# Altium schematic sheet Tone Level.SchDoc: Title
size 431 x 279 mm; Date: *******; ApprovedBy: *******; CheckedBy: Dahami Fernando; Author: *******; CompanyName: *******; DrawnBy: Rivikula Fernando; Engineer: *******; Organization: *******; Address1: *******; Address2: *******; Address3: *******; Address4: *******; DocumentNumber: 5; Revision: *******; SheetNumber: 5; SheetTotal: 7; Subtitle: Tone Level; Project: Distotion_Gitar_Pedal; VersionRevision: 1; TotalSheet: 8; CurrentTime: *******; CurrentDate: *******; Time: *******; DocumentFullPathAndName: *******; DocumentName: *******; ModifiedDate: *******; ImagePath: *******; ProjectName: *******; Application_BuildNumber: *******
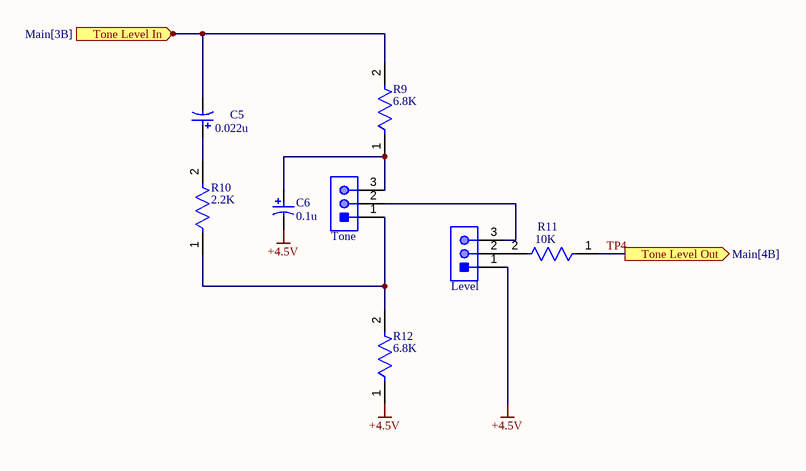
[diagram p0: Tone Level.SchDoc]

## Parts
C5  0.022u  [CAPPR55-200-1100X500X1200]
C6  0.1u  [CAPPR55-200-1100X500X1200]
Level  100K  [TECO-171825-3_V]  (value not drawn)
R9  6.8K  [FP-MRS1600-MFG]
R10  2.2K  [FP-MRS1600-MFG]
R11  10K  [FP-MRS1600-MFG]
R12  6.8K  [FP-MRS1600-MFG]
Tone  20K  [TECO-171825-3_V]  (value not drawn)

## Ports
Tone Level In (in, see Main[3B]), Tone Level Out (out, see Main[4B])

## Nets
+4.5V: C6.2 Level.1 R12.1
Tone Level In: C5.2 R9.2 ; port Tone Level In
TP4: R11.1 ; port Tone Level Out
NetC5_1: C5.1 R10.2
NetC6_1: C6.1 R9.1 Tone.3
NetLevel_2: Level.2 R11.2
NetLevel_3: Level.3 Tone.2
NetR10_1: R10.1 R12.2 Tone.1

## Notes on the sheet
- DWG. NO.
- REV.
- SHT.
- THIS DOCUMENT AND THE DATA DISCLOSED HEREIN OR HEREWITH IS THE PROPERTY OF ALTIUM LIMITED AND MAY BE FREELY DISTRIBUTED IN WHOLE. NO RIGHTS ARE RESERVED OR EXPRESS OR IMPLIED WARANTEE GIVEN.
- REVISION
- DESCRIPTION
- DATE
- APPROVED
- ENG:
- APPROVALS
- PROJECT
- DSN:
- CHK:
- REFERENCE DOCUMENTS
- PROJECT REVISION:
- TITLE
- DOCUMENT REVISION:
- DESIGN ITEM:
- BOM:
- FAB DWG:
- PCB DWG:
- ASSY DWG:
- SCALE:
- SIZE
- B
- CAGE CODE
- FILE NAME
- DWG NO.
- SHEET
- OF
- REV

## Library data of the parts
C5 C6 = CMP-1665-00036-2: Aluminum Electrolytic Capacitor, 22 uF, +/- 20%, 50 V, -40 to 85 degC, 2-Pin THD, RoHS, Bulk; Manufacturer: Panasonic; Ripple Current: 100mA; Life (Hours): 2000Hour; Voltage: 50V; Dissipation Factor: 0.12%; Leakage Current: 3uA; Lead/Base Style: Straight; Capacitance: 22uF; Lead Diameter: 0.5mm; Max Operating Temperature: 85degC; Height: 11mm; Package Reference: CAPPR55-200-1100X500X1200; Radiation Hardening: No; RoHSCompliant: true; Termination: Radial; Case/Package: Radial; REACH SVHC: NoSVHC; Height - Seated (Max): 0.472inch; Min Operating Temperature: -40degC; Packaging: Bulk; Manufacturer URL: http://www.panasonic.com/; Length: 11mm; Tolerance: 20%; Voltage Rating: 50V; Voltage Rating (DC): 50V; Datasheet URL: https://industrial.panasonic.com/cdbs/www-data/pdf/RDF0000/ABA0000C1218.pdf; Lead Pitch: 2mm; Ripple Current (AC): 100mA; Package Description: 2-Pin Radial Lead, Dia 5 mm, Height 12 mm; Diameter: 5mm; Datasheet Version: Rev. 05, 10/2016; Package Quantity: 200; Mount: ThroughHole
Level Tone = CMP-2000-07494-1: Male Header, Pitch 2.5 mm, 1 x 3 Position, Height 10.4 mm, Tail Length 3.6 mm, / -20 to 95 degC / , RoHS, Bulk; Manufacturer: TE Connectivity; Mating Alignment: Yes(With); Tail Length: 0.142inch; Mating Post Length: 7.5mm; PCB Thickness: 0.063inch; PCB Mount Alignment: No(Without); Voltage Rating: 350V; Max Voltage Rating (AC): 250V; Plating Thickness: 0.8um; PCB Mounting Orientation: Vertical; Number of Positions: 3; PCB Mount Retention: Without; Max Current Rating: 3.5A; Max Voltage Rating (DC): 350.25kV; Pitch: 2.5mm; Approvals: UL; Contact Resistance: 20mOhm; Mount: ThroughHole; Length: 7.5mm; Orientation: Straight; Contact Mating Length: 0.295inch; Contact Material: Brass; Housing Material: Nylon; Package Description: Male Header, Pitch 2.5 mm, 1 x 3 Position, Height 10.4 mm, Tail Length 3.6 mm; Colour: Natural; Backwall/Post Interruptions: No(Without); Min Operating Temperature: -20degC; Mating Retention: Yes(With); Connector Type: Header; Packaging: Bag; RoHSCompliant: True; Package Reference: 171825-3; Contact Shape: Square; Strain Relief: No(Without); Contact Gender: Male; Number of Contacts: 3; Manufacturer URL: http://www.te.com/; Height: 0.409inch; Contact Retention: No(Without); Datasheet Version: Rev. Y3, 12/2016; Panel Mount Retention: No(Without); Datasheet URL: http://www.te.com/commerce/DocumentDelivery/DDEController?Action=showdoc&DocId=Customer+Drawing%7F171825%7FY3%7Fpdf%7FEnglish%7FENG_CD_171825_Y3.pdf%7F171825-3; Termination: Solder; Mounting Technology: ThroughHole; Max Operating Temperature: 95degC; Flammability Rating: UL94V-0; REACH SVHC: NoSVHC; Housing Colour: Natural; Package Quantity: 1000; Number of Rows: 1; Depth: 4.9mm; Contact Plating: Tin
R9-R12 = CMP-02408-000019-1: RES 20K OHM 0.4W 1% AXIAL; Max Power Dissipation: 400mW; Temperature Coefficient: 50ppm/°C; Resistance: 20kR; Technology: THIN FILM; Max Operating Temperature: 155°C; Number of Terminations: 2; RoHS Compliant: Yes; Packaging: Tape and Reel; Radiation Hardening: No; Contact Plating: Tin; Military Standard: Not; Construction: Cylindrical; Diameter: 1.6mm; Tolerance: 1%; Mount: Through Hole; Power Rating: 400mW; Case/Package: Conformal; Termination: Axial; Length: 3.6mm; Min Operating Temperature: -55°C; Resistor Type: Metal Film; Series: MRS16